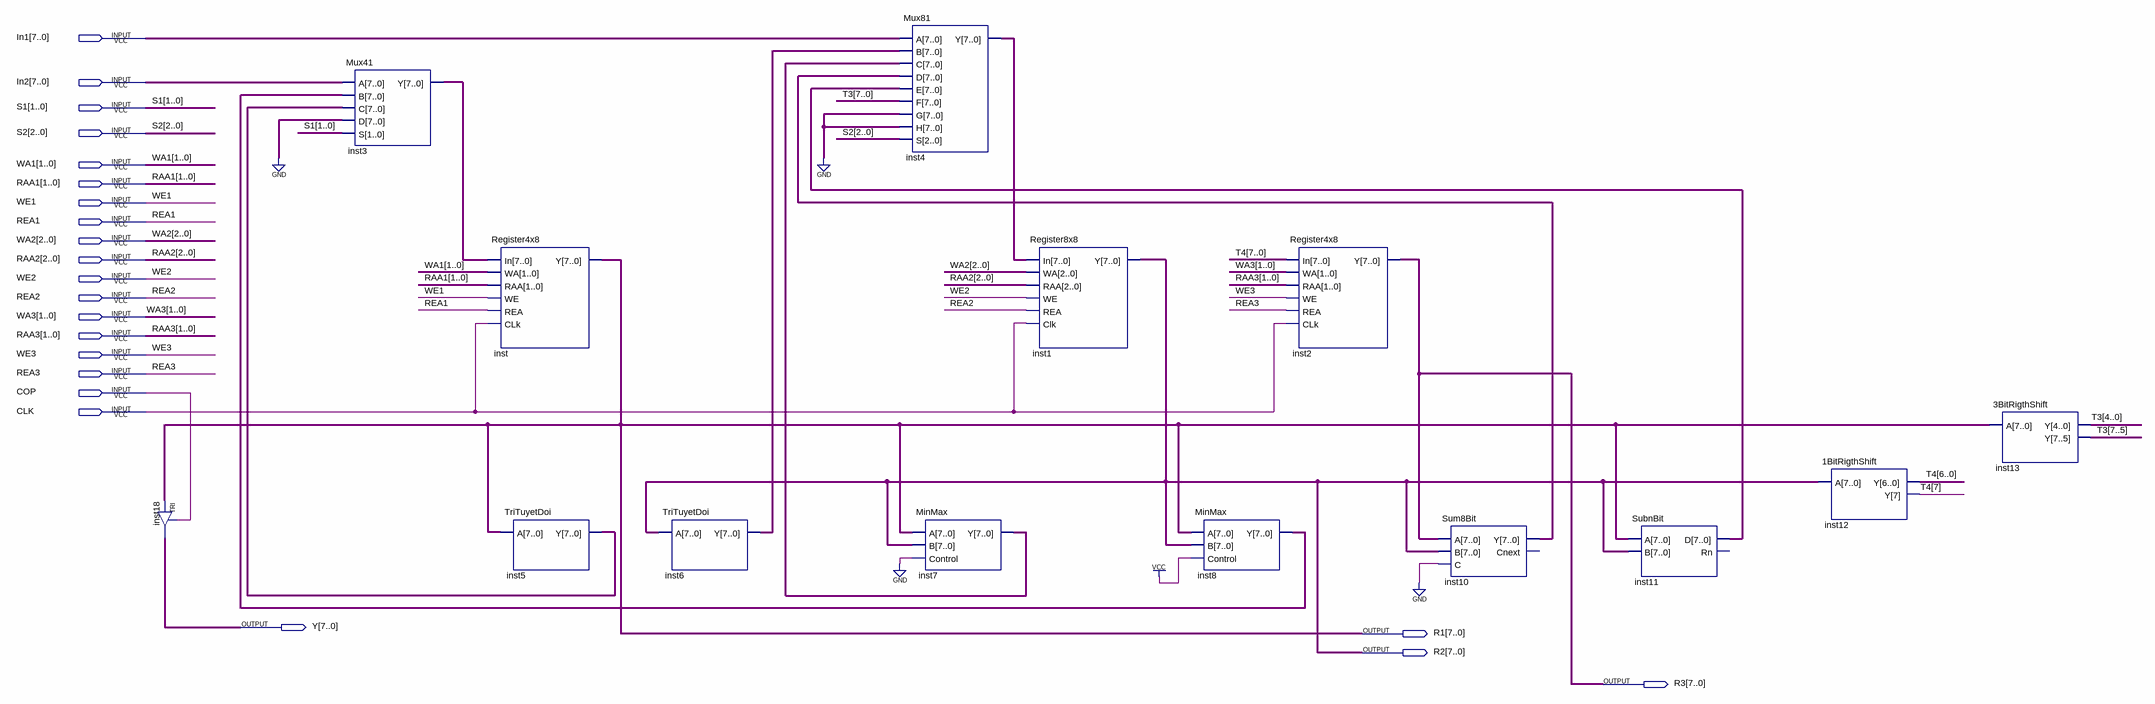
[diagram p0: schematic sheet]
// Quartus schematic Datapath.bdf as structural Verilog: 14 symbols, 22 pins
module Datapath (
  input  [7:0] In1,
  input  [7:0] In2,
  input  [1:0] S1,
  input  [2:0] S2,
  input  [1:0] WA1,
  input  [1:0] RAA1,
  input  WE1,
  input  REA1,
  input  [2:0] WA2,
  input  [2:0] RAA2,
  input  WE2,
  input  REA2,
  input  [1:0] WA3,
  input  [1:0] RAA3,
  input  WE3,
  input  REA3,
  input  COP,
  input  CLK,
  output [7:0] Y,
  output [7:0] R1,
  output [7:0] R2,
  output [7:0] R3
);

  wire [7:0] inst3_y, inst4_y, inst5_y, inst6_y, inst7_y, inst8_y, inst10_y, inst11_d, T3, T4;

  TRI inst18[7:0] (.IN(R1), .OE(COP), .OUT(Y));
  Mux41 inst3 (.A(In2), .B(inst8_y), .C(inst5_y), .D({8{1'b0}}), .S(S1), .Y(inst3_y));
  Register4x8 inst (.In(inst3_y), .WA(WA1), .RAA(RAA1), .WE(WE1), .REA(REA1), .CLk(CLK), .Y(R1));
  TriTuyetDoi inst5 (.A(R1), .Y(inst5_y));
  TriTuyetDoi inst6 (.A(R2), .Y(inst6_y));
  Mux81 inst4 (
    .A(In1), .B(inst6_y), .C(inst7_y), .D(inst10_y), .E(inst11_d), .F(T3), .G({8{1'b0}}), .H({8{1'b0}}),
    .S(S2), .Y(inst4_y));
  MinMax inst7 (.A(R1), .B(R2), .Control(1'b0), .Y(inst7_y));
  Register8x8 inst1 (.In(inst4_y), .WA(WA2), .RAA(RAA2), .WE(WE2), .REA(REA2), .Clk(CLK), .Y(R2));
  MinMax inst8 (.A(R1), .B(R2), .Control(1'b1), .Y(inst8_y));
  Register4x8 inst2 (.In(T4), .WA(WA3), .RAA(RAA3), .WE(WE3), .REA(REA3), .CLk(CLK), .Y(R3));
  Sum8Bit inst10 (.A(R3), .B(R2), .C(1'b0), .Y(inst10_y));  // open: Cnext
  SubnBit inst11 (.A(R1), .B(R2), .D(inst11_d));  // open: Rn
  \1BitRigthShift  inst12 (.A(R2), .Y(T4));
  \3BitRigthShift  inst13 (.A(R1), .Y(T3));
endmodule
